# Altium schematic sheet SH3 - 24V BUCK-BOOST CONVERTER.SchDoc: PDB Rev2 - 24V Buck-Boost Converter
size Letter; DrawnBy: Cindy Li; Organization: UW Robotics; Address1: 200 University Avenue; Address2: Waterloo; Address3: Ontario; Address4: Canada N2L 3G6; DocumentNumber: 3; SheetNumber: 3; SheetTotal: 11
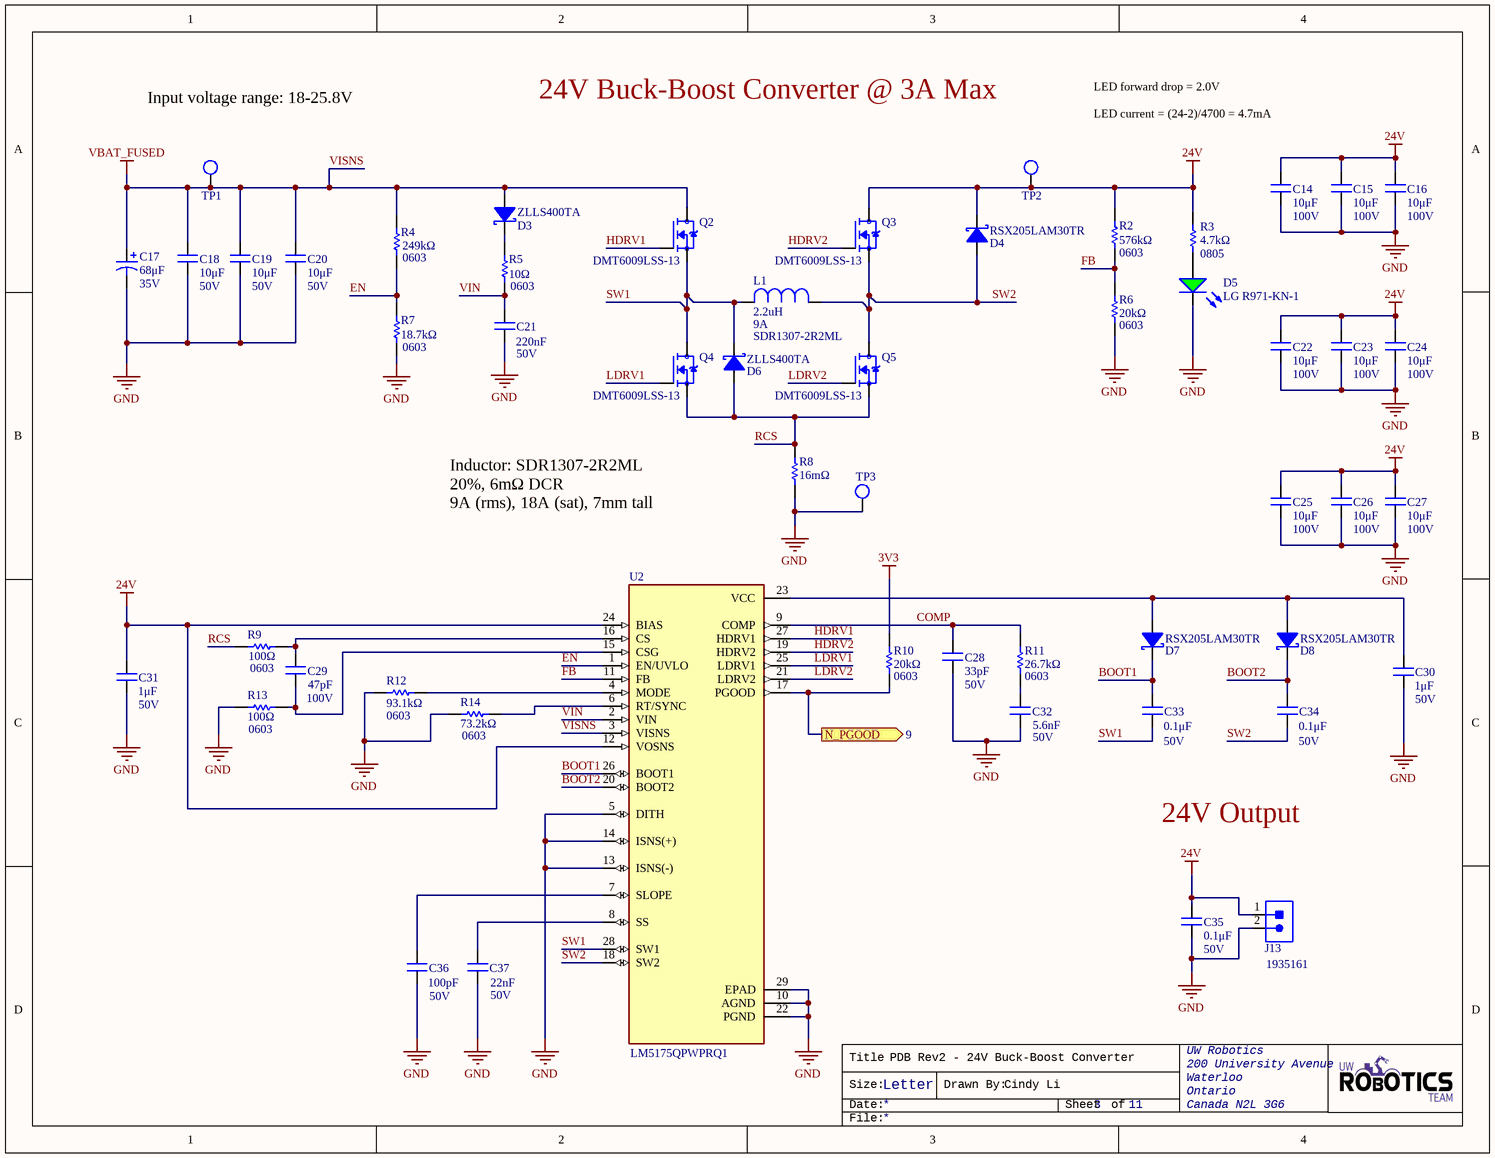
[diagram p0: SH3 - 24V BUCK-BOOST CONVERTER.SchDoc]

## Parts
C14  value 10μF  Voltage Rating: 100V  [CAP1210]  (hidden comment: CAP_10uF_100V_1210)
C15  value 10μF  Voltage Rating: 100V  [CAP1210]  (hidden comment: CAP_10uF_100V_1210)
C16  value 10μF  Voltage Rating: 100V  [CAP1210]  (hidden comment: CAP_10uF_100V_1210)
C17  value 68μF  Voltage Rating: 35V  [RADIAL_NICHION_1V]  (hidden comment: CAP_68uF_35V_ALUM)
C18  value 10μF  Voltage Rating: 50V  [CAP1210]  (hidden comment: CAP_10uF_50V_1210_TDK)
C19  value 10μF  Voltage Rating: 50V  [CAP1210]  (hidden comment: CAP_10uF_50V_1210_TDK)
C20  value 10μF  Voltage Rating: 50V  [CAP1210]  (hidden comment: CAP_10uF_50V_1210_TDK)
C21  value 220nF  Voltage Rating: 50V  [CAP0603]  (hidden comment: CAP_0.22uF_50V_0603)
C22  value 10μF  Voltage Rating: 100V  [CAP1210]  (hidden comment: CAP_10uF_100V_1210)
C23  value 10μF  Voltage Rating: 100V  [CAP1210]  (hidden comment: CAP_10uF_100V_1210)
C24  value 10μF  Voltage Rating: 100V  [CAP1210]  (hidden comment: CAP_10uF_100V_1210)
C25  value 10μF  Voltage Rating: 100V  [CAP1210]  (hidden comment: CAP_10uF_100V_1210)
C26  value 10μF  Voltage Rating: 100V  [CAP1210]  (hidden comment: CAP_10uF_100V_1210)
C27  value 10μF  Voltage Rating: 100V  [CAP1210]  (hidden comment: CAP_10uF_100V_1210)
C28  value 33pF  Voltage Rating: 50V  [CAP2012]  (hidden comment: CAP_33pF_50V_0805)
C29  value 47pF  Voltage Rating: 100V  [CAP0603]  (hidden comment: CAP_47pF_100V_0603)
C30  value 1μF  Voltage Rating: 50V  [CAP0603]  (hidden comment: CAP_1uF_50V_0603)
C31  value 1μF  Voltage Rating: 50V  [CAP0603]  (hidden comment: CAP_1uF_50V_0603)
C32  Capacitance: 5.6nF  Voltage Rating: 50V  [CAP2012]  (hidden comment: 5600pF)
C33  Voltage Rating: 50V  [CAP2012]  (hidden comment: 0.1μF)
C34  Voltage Rating: 50V  [CAP2012]  (hidden comment: 0.1μF)
C35  0.1μF  Voltage Rating: 50V  [CAP2012]
C36  value 100pF  Voltage Rating: 50V  [CAP0603]  (hidden comment: CAP_100pF_0603)
C37  value 22nF  Voltage Rating: 50V  [CAP2012]  (hidden comment: 0.022μF)
D3  Manufacturer Part Number 1: ZLLS400TA  [SOD-323]  (hidden comment: DIO_SCHOTTKY_40V_520mA)
D4  Manufacturer Part Number 1: RSX205LAM30TR  [SOD-128]  (hidden comment: DIO_SCHOTTKY_30V_2A)
D5  LG R971-KN-1  [LED_0805_GREEN]
D6  Manufacturer Part Number 1: ZLLS400TA  [SOD-323]  (hidden comment: DIO_SCHOTTKY_40V_520mA)
D7  Manufacturer Part Number 1: RSX205LAM30TR  [SOD-128]  (hidden comment: DIO_SCHOTTKY_30V_2A)
D8  Manufacturer Part Number 1: RSX205LAM30TR  [SOD-128]  (hidden comment: DIO_SCHOTTKY_30V_2A)
J13  1935161  [1935161]
L1  Current Rating: 9A  Manufacturer Part Number 1: SDR1307-2R2ML  Inductance: 2.2uH  [IND_BOURNS_SDR1307]  (hidden comment: IND_2.2uH_9A)
Q2  Manufacturer Part Number 1: DMT6009LSS-13  [TRANS_DMP2002UPS-13]  (hidden comment: NMOS_60V_10.8A)
Q3  Manufacturer Part Number 1: DMT6009LSS-13  [TRANS_DMP2002UPS-13]  (hidden comment: NMOS_60V_10.8A)
Q4  Manufacturer Part Number 1: DMT6009LSS-13  [TRANS_DMP2002UPS-13]  (hidden comment: NMOS_60V_10.8A)
Q5  Manufacturer Part Number 1: DMT6009LSS-13  [TRANS_DMP2002UPS-13]  (hidden comment: NMOS_60V_10.8A)
R2  value 576kΩ  Case Code (Imperial): 0603  [RESC0603(1608)_N]  (hidden comment: RES_576kΩ_0603)
R3  value 4.7kΩ  Case Code (Imperial): 0805  [RESC2012X60N]  (hidden comment: RES_4.7kΩ_0805)
R4  value 249kΩ  Case Code (Imperial): 0603  [RESC0603(1608)_N]  (hidden comment: RES_249kΩ_0603)
R5  value 10Ω  Case Code (Imperial): 0603  [RESC0603(1608)_N]  (hidden comment: RES_10Ω_0603)
R6  value 20kΩ  Case Code (Imperial): 0603  [RESC0603(1608)_N]  (hidden comment: RES_20kΩ_0603)
R7  value 18.7kΩ  Case Code (Imperial): 0603  [RESC0603(1608)_N]  (hidden comment: RES_18.7kΩ_0603_1%)
R8  value 16mΩ  [RESC1632X60N]  (hidden comment: RES_16mΩ_1206)
R9  value 100Ω  Case Code (Imperial): 0603  [RESC0603(1608)_N]  (hidden comment: RES_100Ω_0603)
R10  value 20kΩ  Case Code (Imperial): 0603  [RESC0603(1608)_N]  (hidden comment: RES_20kΩ_0603)
R11  value 26.7kΩ  Case Code (Imperial): 0603  [RESC0603(1608)_N]  (hidden comment: RES_26.7kΩ_0603)
R12  value 93.1kΩ  Case Code (Imperial): 0603  [RESC0603(1608)_N]  (hidden comment: RES_93.1kΩ_0603)
R13  value 100Ω  Case Code (Imperial): 0603  [RESC0603(1608)_N]  (hidden comment: RES_100Ω_0603)
R14  value 73.2kΩ  Case Code (Imperial): 0603  [RESC0603(1608)_N]  (hidden comment: RES_73.2kΩ_0603)
TP1  TESTPOINT_LOOP  [TESTPOINT_LOOP]  (value not drawn)
TP2  TESTPOINT_LOOP  [TESTPOINT_LOOP]  (value not drawn)
TP3  TESTPOINT_LOOP  [TESTPOINT_LOOP]  (value not drawn)
U2  Manufacturer Part Number 1: LM5175QPWPRQ1  [IC_TPS61196PWPRQ1]  (hidden comment: LM5175PWPR)

## Ports
N_PGOOD (out, see 9)

## Nets
3V3: R10.2
24V: C14.1 C15.1 C16.2 C22.1 C23.1 C24.2 C25.1 C26.1 C27.2 C31.2 C35.2 D4.2(Cathode) J13.1 Q3.1(D) R2.2 R3.2 TP2.1 U2.12(VOSNS) U2.24(BIAS)
GND: C14.2 C15.2 C16.1 C17.2 C18.1 C19.1 C20.1 C21.1 C22.2 C23.2 C24.1 C25.2 C26.2 C27.1 C28.1 C30.1 C31.1 C32.1 C35.1 C36.1 C37.1 D5.2(K) J13.2 R6.1 R7.1 R8.1 R12.1 R13.1 R14.1 TP3.1 U2.5(DITH) U2.10(AGND) U2.13(ISNS(-)) U2.14(ISNS(+)) U2.22(PGND) U2.29(EPAD)
VISNS: C17.1 C18.2 C19.2 C20.2 D3.1(Anode) Q2.1(D) R4.2 TP1.1 U2.3(VISNS)  [also labelled VBAT_FUSED]
BOOT1: C33.2 D7.2(Cathode) U2.26(BOOT1)
BOOT2: C34.2 D8.2(Cathode) U2.20(BOOT2)
COMP: C28.2 R11.2 U2.9(COMP)
EN: R4.1 R7.2 U2.1(EN/UVLO)
FB: R2.1 R6.2 U2.11(FB)
HDRV1: Q2.3(G) U2.27(HDRV1)
HDRV2: Q3.3(G) U2.19(HDRV2)
LDRV1: Q4.3(G) U2.25(LDRV1)
LDRV2: Q5.3(G) U2.21(LDRV2)
N_PGOOD: R10.1 U2.17(PGOOD) ; port N_PGOOD
RCS: D6.1(Anode) Q4.2(S) Q5.2(S) R8.2 R9.1
SW1: C33.1 D6.2(Cathode) L1.2 Q2.2(S) Q4.1(D) U2.28(SW1)
SW2: C34.1 D4.1(Anode) L1.1 Q3.2(S) Q5.1(D) U2.18(SW2)
VIN: C21.2 R5.1 U2.2(VIN)
NetC29_1: C29.1 R9.2 U2.16(CS)
NetC29_2: C29.2 R13.2 U2.15(CSG)
NetC30_2: C30.2 D7.1(Anode) D8.1(Anode) U2.23(VCC)
NetC32_2: C32.2 R11.1
NetC36_2: C36.2 U2.7(SLOPE)
NetC37_2: C37.2 U2.8(SS)
NetD3_2: D3.2(Cathode) R5.2
NetD5_1: D5.1(A) R3.1
NetR12_2: R12.2 U2.4(MODE)
NetR14_2: R14.2 U2.6(RT/SYNC)

## Notes on the sheet
- 24V Buck-Boost Converter @ 3A Max
- Input voltage range: 18-25.8V
- LED forward drop = 2.0V
  LED current = (24-2)/4700 = 4.7mA
- Inductor: SDR1307-2R2ML
  20%, 6mΩ DCR
  9A (rms), 18A (sat), 7mm tall
- 24V Output
- Title
- Size:
- Date:
- Letter
- Drawn By:
- Sheet
- of
- File:

## Library data of the parts
C14-C16 C22-C27 = CAP_10uF_100V_1210: CAP CER 10uF 100V X7S 10% 1210; Manufacturer 1: Murata; Manufacturer Part Number 1: GRM32EC72A106KE05L; Mount: Surface Mount; Case Code (Metric): 3225; Case Code (Imperial): 1210; Min Operating Temperature: -55°C; Max Operating Temperature: 125°C; Tolerance: 10%; Dielectric: X7S; Supplier 1: Digi-Key; Supplier Part Number 1: 490-16266-1-ND; Package: 1210 (3225 Metric); Category: Ceramic Capacitors
C17 = CAP_68uF_35V_ALUM: CAP ALUM 68UF 20% 35V SMD; Manufacturer 1: Nichicon; Manufacturer Part Number 1: UUD1V680MCL1GS; ESR (Equivalent Series Resistance): 340mR; Polarity: Polar; Voltage Rating (DC): 50V; Supplier 1: Digi-Key; Mount: Surface Mount; Min Operating Temperature: -55°C; Max Operating Temperature: 105°C; Tolerance: 20%; Diameter: 6.3mm; Height - Seated (Max): 7.7mm; Supplier Part Number 1: 493-2289-1-ND
C18-C20 = CAP_10uF_50V_1210_TDK: CAP CER 10UF 50V X7R 1210; Manufacturer 1: TDK Corporation; Manufacturer Part Number 1: C3225X7R1H106M250AC; Tolerance: 20%; Mount: Surface Mount; Case Code (Metric): 3225; Case Code (Imperial): 1210; Min Operating Temperature: -55°C; Max Operating Temperature: 125°C; Dielectric: X7R; Termination: SMD/SMT; Supplier 1: Digi-Key; Supplier Part Number 1: 445-14933-1-ND; Package: 1210 (3225 Metric)
C21 = CAP_0.22uF_50V_0603: CAP CER 0.22UF 50V X7R 0603; Manufacturer Part Number 1: CGA3E3X7R1H224K080AB; Manufacturer 1: TDK Corporation; Dimensions: 0.063" L x 0.031" W (1.60mm x 0.80mm); Package: 0603 (1608 Metric); Temperature Coefficient: X7R; Supplier Part Number 1: 445-6926-1-ND; Supplier 1: Digi-Key; Mount: Surface Mount; Case Code (Imperial): 0603; Case Code (Metric): 1608; Dielectric: X7R
C28 = CAP_33pF_50V_0805: CAP CER 33PF 50V C0G/NP0 0805; Manufacturer 1: Samsung Electro-Mechanics; Manufacturer Part Number 1: CL21C330JBANNNC; Tolerance: 5%; Mount: Surface Mount; Case Code (Metric): 2012; Case Code (Imperial): 0805; Min Operating Temperature: -55°C; Max Operating Temperature: 125°C; Dielectric: C0G/NP0; Termination: SMD/SMT; Supplier 1: Digi-Key; Supplier Part Number 1: 1276-1105-1-ND; Package: 0805 (2012 Metric)
C29 = CAP_47pF_100V_0603: CAP CER 47PF 100V C0G/NP0 0603; Manufacturer Part Number 1: C0603C470J1GACTU; Manufacturer 1: KEMET; Temperature Coefficient: C0G; Dielectric: C0G, NP0; Dimensions: 0.063" L x 0.031" W (1.60mm x 0.80mm); Package: 0603 (1608 Metric); Supplier Part Number 1: 399-7917-1-ND; Supplier 1: Digi-Key; Mount: Surface Mount; Case Code (Imperial): 0603; Case Code (Metric): 1608
C30 C31 = CAP_1uF_50V_0603: CAP CER 1UF 50V X6S 0603; Manufacturer Part Number 1: C1608X6S1H105K080AC; Manufacturer 1: TDK Corporation; Dimensions: 0.063" L x 0.031" W (1.60mm x 0.80mm); Package: 0603 (1608 Metric); Temperature Coefficient: X6S; Supplier Part Number 1: 445-7424-1-ND; Supplier 1: Digi-Key; Mount: Surface Mount; Case Code (Imperial): 0603; Case Code (Metric): 1608; Dielectric: X6S
C32 = CAP_5600pF_50V_0805: CAP CER 5600PF 50V C0G 0805; Manufacturer 1: TDK Corporation; Manufacturer Part Number 1: CGA4C2C0G1H562J060AA; Tolerance: 5%; Mount: Surface Mount; Package: 0805 (2012 Metric); Number of Pins: 2; Case Code (Imperial): 0805; Case Code (Metric): 2012; Min Operating Temperature: -55°C; Max Operating Temperature: 125°C; Voltage Rating (DC): 50V; Termination: SMD/SMT; Length: 0.079inch; Width: 0.049inch; Thickness: 0.037inch; Depth: 1.25mm; Ratings: AEC-Q200; Supplier 1: Digi-Key; Supplier Part Number 1: 445-6944-1-ND; Dielectric: C0G
C33-C35 = CAP_0.1uF_50V_0805: CAP CER 0.1UF 50V X7R 0805; Manufacturer 1: Murata Electronics; Manufacturer Part Number 1: GCD21BR71H104KA01L; Tolerance: 10%; Mount: Surface Mount; Case Code (Metric): 2012; Case Code (Imperial): 0805; Min Operating Temperature: -55°C; Max Operating Temperature: 125°C; Termination: SMD/SMT; Length: 2mm; Height: 1.25mm; Width: 0.049inch; Thickness: 0.049inch; Depth: 1.25mm; Ratings: AEC-Q200; Supplier 1: Digi-Key; Supplier Part Number 1: 490-11955-1-ND; Package: 0805 (2012 Metric); Dielectric: X7R; Value: 0.1μF
C36 = CAP_100pF_0603: CAP CER 100PF 50V C0G/NP0 0603; Manufacturer Part Number 1: VJ0603A101JXAAC; Manufacturer 1: Vishay Vitramon; Temperature Coefficient: C0G; Dielectric: C0G, NP0; Dimensions: 0.063" L x 0.031" W (1.60mm x 0.80mm); Package: 0603 (1608 Metric); Supplier Part Number 1: 720-1370-1-ND; Supplier 1: Digi-Key; Mount: Surface Mount; Case Code (Imperial): 0603; Case Code (Metric): 1608
C37 = CAP_0.022uF_50V_0805: CAP CER 0.022UF 50V C0G 0805; Manufacturer 1: TDK Corporation; Manufacturer Part Number 1: CGA4J2C0G1H223J125AA; Tolerance: 5%; Mount: Surface Mount; Case Code (Metric): 2012; Case Code (Imperial): 0805; Min Operating Temperature: -55°C; Max Operating Temperature: 125°C; Termination: SMD; Length: 2mm; Height: 1.25mm; Width: 0.049inch; Thickness: 0.049inch; Depth: 1.25mm; Ratings: AEC-Q200; Supplier 1: Digi-Key; Supplier Part Number 1: 445-6949-1-ND; Package: 0805 (2012 Metric); Dielectric: C0G
D3 D6 = DIO_SCHOTTKY_40V_520mA: DIODE SCHOTTKY 40V 520MA SOD323; Manufacturer 1: Diodes Incorporated; Supplier 1: Digi-Key; Supplier Part Number 1: ZLLS400TACT-ND; Mount: Surface Mount; Vr (Max): 40V; Io: 520mA
D4 D7 D8 = DIO_SCHOTTKY_30V_2A: DIODE SCHOTTKY 30V 2A PMDTM; Manufacturer 1: Rohm Semiconductor; Vf (Max): 490mV; Supplier 1: Digi-Key; Supplier Part Number 1: RSX205LAM30CT-ND; Mount: Surface Mount; Vr (Max): 30V; Io: 2A
D5 = DIO_LED_G: LED GREEN DIFFUSED 0805 SMD; Manufacturer 1: OSRAM; Forward Voltage Drop: 2.2V; Package: 0805 (2012 Metric); Manufacturer Part Number 1: LG R971-KN-1; Supplier Part Number 1: 475-1410-1-ND; Supplier 1: Digi-Key; Mount: Surface Mount
J13 = CON_2M_TERM: TERM BLK 2POS SIDE ENTRY 5MM; Manufacturer 1: Phoenix Contact; Connector Type: Screw; Voltage Rating (DC): 320V; Max Current Rating: 16A; Max Supply Voltage: 250V; Current Rating: 17.5A; Number of Poles: 2; Number of Levels: 1; Current: 18A; Voltage: 300V; Wire Gauge (Max): 26AWG; Wire Gauge (Min): 12AWG; Approvals: UL; Supplier 1: Digi-Key; Mount: Through Hole; Number of Pins: 2; Weight: 0.067021oz; Contact Material: Copper,Tin; Insulation Material: Nylon; Housing Material: Polyamide; Housing Color: Green; Color: Green; Material: Nylon; Number of Rows: 1; Voltage Rating: 250V; Number of Positions: 2; Number of Positions Per Level: 2; Termination: Solder; Number of Contacts: 2; Number of Circuits: 2; Orientation: Straight; Length: 9mm; Height: 11.3mm; Width: 14.9mm; Pitch: 5mm; Depth: 9mm; Wire/Cable Gauge: 26AWG; Flammability Rating: UL94 V-0; REACH SVHC: Unknown; Supplier Part Number 1: 277-1667-ND; Manufacturer Part Number 1: 1935161
L1 = IND_2.2uH_9A: FIXED IND 2.2UH 9A 6 MOHM SMD; Manufacturer 1: Bourns; Core Material: Ferrite; DC Resistance (DCR): 6mOhm; Tolerance: 20%; Supplier 1: Digi-Key; Category: Fixed Inductors; Mount: Surface Mount; Case/Package: Nonstandard; Number of Pins: 2; Min Operating Temperature: -40°C; Max Operating Temperature: 125°C; Termination: SMD/SMT; Composition: Wirewound; Diameter: 13mm; Length: 0.512inch; Height - Seated (Max): 0.287inch; Supplier Part Number 1: SDR1307-2R2MLCT-ND
Q2-Q5 = NMOS_60V_10.8A: MOSFET BVDSS: 41V 60V,SO-8,T&R,2; Manufacturer 1: Texas Instruments; Continuous Drain Current (Id) @ 25°C: 10.8A (Ta); Drive Voltage (Max Rds On, Min Rds On): 4.5V, 10V; Rds On (Max) @ Id, Vgs: 59mOhm @ 5A, 10V; Vgs(th) (Max) @ Id: 9.5mOhm @ 13.5A, 10V; Vgs (Max): ±20V; Power Dissipation (Max): 1.25W (Ta); Supplier 1: Digi-Key; Supplier Part Number 1: DMT6009LSS-13DICT-ND; Operating Temperature: -55°C - 150°C (TJ); Mounting Type: Surface Mount; Package / Case: 8-SOIC (0.154"", 3.90mm Width); Drain to Source Voltage (Vdss): 60V
R2 = RES_576kΩ_0603_1%: RES 576K OHM 1% 1/10W 0603; Manufacturer 1: Yageo; Manufacturer Part Number 1: RC0603FR-07576KL; Package: 0603 (1608 Metric); Dimensions: 0.063" L x 0.031" W (1.60mm x 0.80mm); Supplier Part Number 1: 311-576KHRCT-ND; Supplier 1: Digi-Key; Mount: Surface Mount; Case Code (Metric): 1608; Tolerance: 1%
R3 = RES_4.7kΩ_0805_5%: RES 4.7K OHM 5% 1/8W 0805; Manufacturer 1: Yageo; Manufacturer Part Number 1: RC0805JR-074K7L; Resistance: 4.7kR; Temperature Coefficient: 100ppm/°C; Power Rating: 125mW; Voltage Rating: 150V; Supplier 1: Digi-Key; Contact Plating: Tin,Lead,Matte; Case Code (Metric): 2012; Min Operating Temperature: -55°C; Max Operating Temperature: 155°C; Tolerance: 5%; Composition: Thick Film; Termination: SMD/SMT; Military Standard: Not; Length: 2mm; Depth: 1.25mm; REACH SVHC: Unknown; Supplier Part Number 1: 311-4.7KARCT-ND; Mount: Surface Mount; Package: 0805 (2012 Metric)
R4 = RES_249kΩ_0603_1%: RES 249K OHM 1% 1/10W 0603; Manufacturer 1: Stackpole Electronics Inc; Manufacturer Part Number 1: RMCF0603FT249K; Power: 0.1W; Package: 0603 (1608 Metric); Dimensions: 0.063" L x 0.031" W (1.60mm x 0.80mm); Supplier Part Number 1: RMCF0603FT249KCT-ND; Supplier 1: Digi-Key; Mount: Surface Mount; Case Code (Metric): 1608; Tolerance: 1%
R5 = RES_10Ω_0603_1%: RES 10 OHM 1% 1/10W 0603; Manufacturer 1: Vishay Dale; Manufacturer Part Number 1: CRCW060310R0FKEA; Package: 0603 (1608 Metric); Dimensions: 0.063" L x 0.031" W (1.60mm x 0.80mm); Supplier Part Number 1: 541-10.0HCT-ND; Supplier 1: Digi-Key; Mount: Surface Mount; Case Code (Metric): 1608; Tolerance: 1%
R6 R10 = RES_20kΩ_0603_1%: RES 20K OHM 1% 1/10W 0603; Manufacturer 1: Yageo; Manufacturer Part Number 1: RC0603FR-0720KL; Dimensions: 0.063" L x 0.031" W (1.60mm x 0.80mm); Supplier Part Number 1: 311-20.0KHRCT-ND; Supplier 1: Digi-Key; Mount: Surface Mount; Case Code (Metric): 1608; Package: 0603 (1608 Metric); Tolerance: 1%
R7 = RES_18.7kΩ_0603_1%: RES 18.7K OHM 1% 1/10W 0603; Manufacturer 1: Vishay Dale; Manufacturer Part Number 1: CRCW060318K7FKEA; Power Rating: 100mW; Package: 0603 (1608 Metric); Dimensions: 0.063" L x 0.031" W (1.60mm x 0.80mm); Supplier Part Number 1: 541-18.7KHCT-ND; Supplier 1: Digi-Key; Mount: Surface Mount; Case Code (Metric): 1608; Min Operating Temperature: -55°C; Max Operating Temperature: 155°C; Termination: SMD/SMT; Length: 2mm; Height: 0.45mm; Width: 0.049inch; Depth: 1.25mm; Tolerance: 1%
R8 = RES_16mΩ_1206_1%: RES 0.016 OHM 1W 1206 WIDE; Manufacturer 1: Susumu; Manufacturer Part Number 1: PRL1632-R016-F-T1; Tolerance: 1%; Supplier Part Number 1: PRL1632.016FCT-ND; Supplier 1: Digi-Key; Mount: Surface Mount; Package: 1206
R9 R13 = RES_100Ω_0603_1%: RES 100 OHM 1% 1/10W 0603; Manufacturer 1: Yageo; Manufacturer Part Number 1: RC0603FR-07100RL; Package: 0603 (1608 Metric); Dimensions: 0.063" L x 0.031" W (1.60mm x 0.80mm); Supplier Part Number 1: 311-100HRCT-ND; Supplier 1: Digi-Key; Mount: Surface Mount; Case Code (Metric): 1608; Tolerance: 1%
R11 = RES_26.7kΩ_0603_1%: RES 26.7K OHM 1% 1/10W 0603; Manufacturer 1: Yageo; Manufacturer Part Number 1: RC0603FR-0726K7L; Power: 0.1W; Package: 0603 (1608 Metric); Dimensions: 0.063" L x 0.031" W (1.60mm x 0.80mm); Supplier Part Number 1: 311-26.7KHRCT-ND; Supplier 1: Digi-Key; Mount: Surface Mount; Case Code (Metric): 1608; Tolerance: 1%
R12 = RES_93.1kΩ_0603_1%: RES 93.1K OHM 1% 1/10W 0603; Manufacturer 1: Vishay Dale; Manufacturer Part Number 1: CRCW060393K1FKEA; Dimensions: 0.063" L x 0.031" W (1.60mm x 0.80mm); Package: 0603 (1608 Metric); Supplier Part Number 1: 541-93.1KHCT-ND; Supplier 1: Digi-Key; Mount: Surface Mount; Case Code (Metric): 1608; Tolerance: 1%
R14 = RES_73.2kΩ_0603_1%: RES 73.2K OHM 1% 1/16W 0603; Manufacturer 1: TE Connectivity Passive Product; Manufacturer Part Number 1: CPF0603F73K2C1; Package: 0603 (1608 Metric); Dimensions: 0.063" L x 0.031" W (1.60mm x 0.80mm); Supplier Part Number 1: A102314CT-ND; Supplier 1: Digi-Key; Mount: Surface Mount; Case Code (Metric): 1608; Tolerance: 1%
TP1-TP3 = TESTPOINT_LOOP: PC TEST POINT MINIATURE WHITE; Manufacturer 1: Keystone Electronics; Manufacturer Part Number 1: 5002; Supplier 1: Digi-Key; Mount: Through Hole; Supplier Part Number 1: 36-5002-ND
U2 = LM5175PWPR: IC REG CTRLR BUCK-BOOST 28HTSSOP; Manufacturer 1: Texas Instruments; Supply Voltage: 3.5V - 42V; Switching Frequency: 100kHz - 600kHz; Synchronous Rectifier: Yes; Control Features: Enable, Frequency Control, Power Good, Soft Start; Number of Outputs: 1; Supplier 1: Digi-Key; Supplier Part Number 1: 296-44175-1-ND; Clock Sync: Yes; Operating Temperature: -40°C - 150°C (TJ); Mounting Type: Surface Mount; Package / Case: 28-PowerTSSOP (0.173", 4.40mm Width)